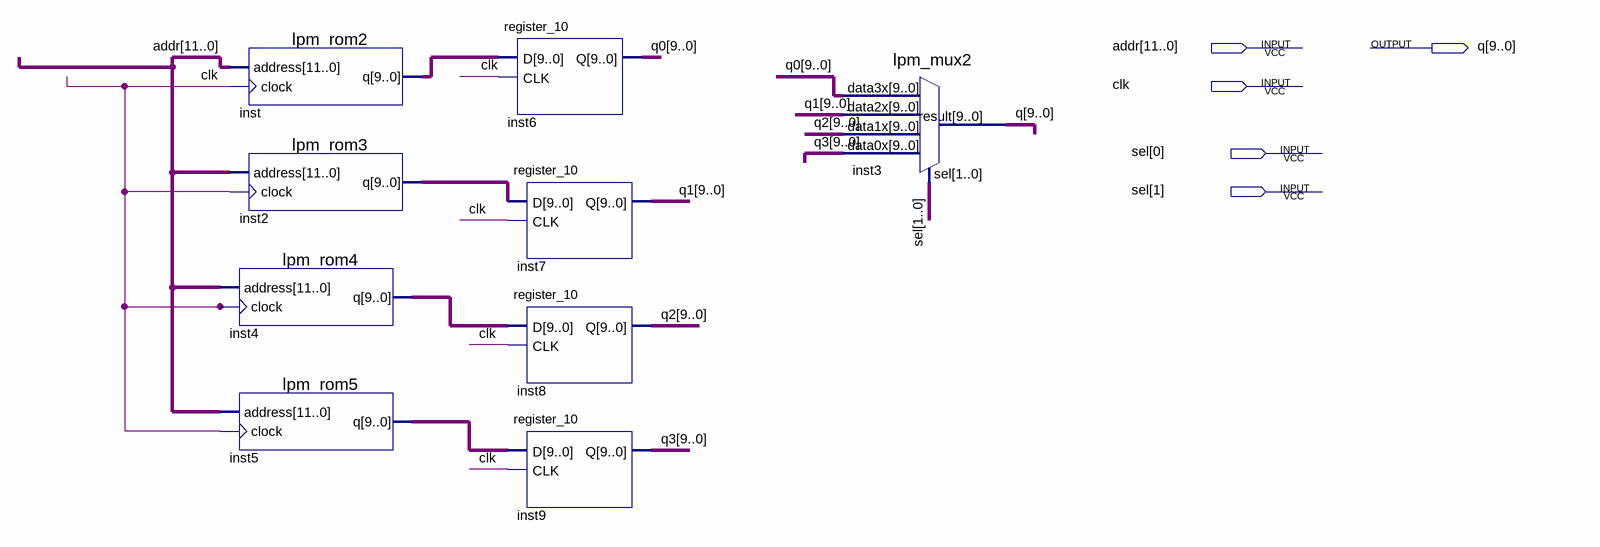
[diagram p0: schematic sheet]
// Quartus schematic xuanze.bdf as structural Verilog: 9 symbols, 5 pins
module xuanze (
  input  [11:0] addr,
  input  clk,
  input  [1:0] sel,
  output [9:0] q
);

  wire [9:0] inst2_q, inst4_q, inst5_q, inst_q, q0, q1, q2, q3;

  lpm_rom4 inst4 (.address(addr), .clock(clk), .q(inst4_q));
  lpm_rom5 inst5 (.address(addr), .clock(clk), .q(inst5_q));
  lpm_rom2 inst (.address(addr), .clock(clk), .q(inst_q));
  lpm_rom3 inst2 (.address(addr), .clock(clk), .q(inst2_q));
  register_10 inst6 (.D(inst_q), .CLK(clk), .Q(q0));
  register_10 inst7 (.D(inst2_q), .CLK(clk), .Q(q1));
  register_10 inst8 (.D(inst4_q), .CLK(clk), .Q(q2));
  register_10 inst9 (.D(inst5_q), .CLK(clk), .Q(q3));
  lpm_mux2 inst3 (.data3x(q0), .data2x(q1), .data1x(q2), .data0x(q3), .sel(sel), .result(q));
endmodule
